# Altium schematic sheet schematic.SchDoc
size A; SheetNumber: 1; SheetTotal: 1
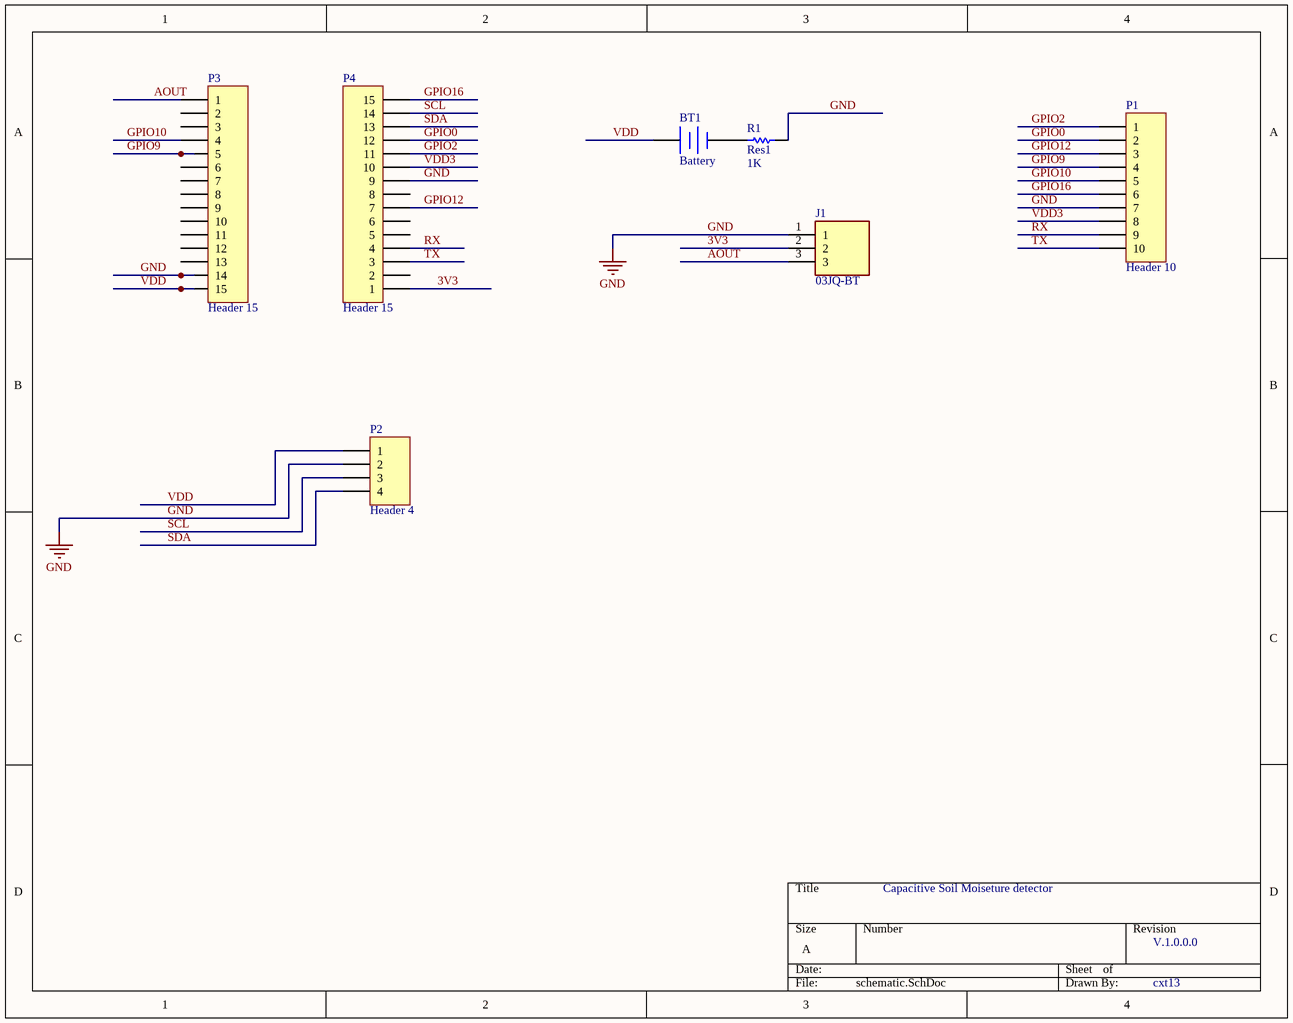
[diagram p0: schematic.SchDoc]

## Parts
BT1  Battery  [BAT-2]
J1  03JQ-BT  [SHDR3W80P0X250_1X3_1000X600X950P]
P1  Header 10  [HDR1X10]
P2  Header 4  [HDR1X4]
P3  Header 15  [HDR1X15]
P4  Header 15  [HDR1X15]
R1  Res1  value 1K  [AXIAL-0.3]

## Nets
GND: J1.1 P1.7 P2.2 P3.14 P4.9 R1.2
3V3: J1.2 P4.1
AOUT: J1.3 P3.1
GPIO0: P1.2 P4.12
GPIO2: P1.1 P4.11
GPIO9: P1.4 P3.5
GPIO10: P1.5 P3.4
GPIO12: P1.3 P4.7
GPIO16: P1.6 P4.15
RX: P1.9 P4.4
SCL: P2.3 P4.14
SDA: P2.4 P4.13
TX: P1.10 P4.3
VDD: BT1.1(+) P2.1 P3.15
VDD3: P1.8 P4.10
NetBT1_2: BT1.2(-) R1.1

Not connected (* = marked no-connect by the designer): P3 2 3 6 7 8 9 10 11 12 13; P4 2 5 6 8

## Notes on the sheet
- Capacitive Soil Moiseture detector
- V.1.0.0.0
- cxt13

## Library data of the parts
BT1 = Battery: Multicell Battery; Published: 24-Mar-1999; LatestRevisionDate: 17-Jul-2002; LatestRevisionNote: Re-released for DXP Platform.; PackageReference: BAT-2; Publisher: Altium Limited; PackageDescription: Battery; 2 Leads
J1 = 03JQ-BT: Connector; Manufacturer_Name: JST (JAPAN SOLDERLESS TERMINALS); Datasheet Link: http://www.jst-mfg.com/product/pdf/eng/eJQ.pdf; Height: 9.5mm; Manufacturer_Part_Number: 03JQ-BT; Mouser Part Number: N/A; Mouser Price/Stock: https://www.mouser.com/Search/Refine.aspx?Keyword=N%2FA
P1 = Header 10: Header, 10-Pin; LatestRevisionDate: 17-Jul-2002; LatestRevisionNote: Re-released for DXP Platform.; Publisher: Altium Limited
P2 = Header 4: Header, 4-Pin; LatestRevisionDate: 17-Jul-2002; LatestRevisionNote: Re-released for DXP Platform.; Publisher: Altium Limited
P3 P4 = Header 15: Header, 15-Pin; LatestRevisionDate: 17-Jul-2002; LatestRevisionNote: Re-released for DXP Platform.; Publisher: Altium Limited
R1 = Res1: Resistor; Published: 8-Jun-2000; LatestRevisionDate: 17-Jul-2002; LatestRevisionNote: Re-released for DXP Platform.; PackageReference: AXIAL-0.3; Publisher: Altium Limited; PackageDescription: Axial Device, Thru-Hole; 2 Leads; 0.3 in Pin Spacing